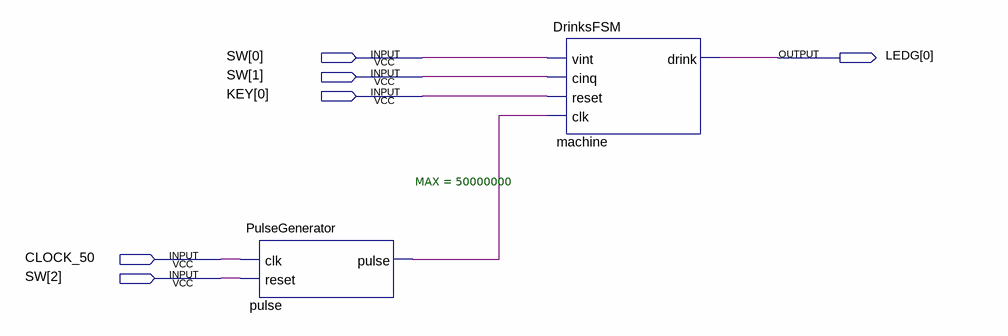
[diagram p0: schematic sheet]
// Quartus schematic DrinksFSMdemo.bdf as structural Verilog: 2 symbols, 6 pins
module DrinksFSMdemo (
  input  [2:0] SW,
  input  [0:0] KEY,
  input  CLOCK_50,
  output [0:0] LEDG
);

  wire pulse_pulse;

  PulseGenerator #(.MAX(50000000)) pulse (.clk(CLOCK_50), .reset(SW[2]), .pulse(pulse_pulse));
  DrinksFSM machine (.vint(SW[0]), .cinq(SW[1]), .reset(KEY[0]), .clk(pulse_pulse), .drink(LEDG[0]));
endmodule
